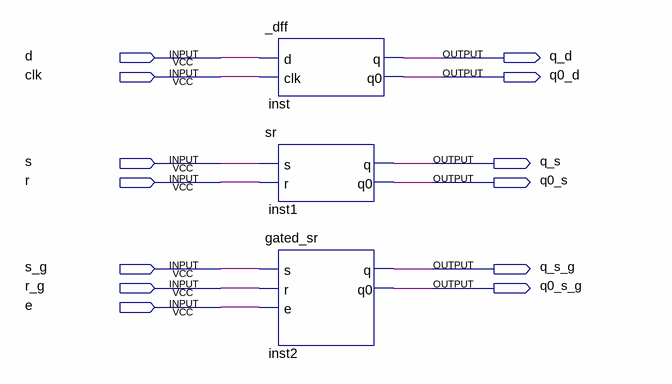
[diagram p0: schematic sheet]
// Quartus schematic latches.bdf as structural Verilog: 3 symbols, 13 pins
module latches (
  input  d,
  input  clk,
  input  s,
  input  r,
  input  s_g,
  input  r_g,
  input  e,
  output q_d,
  output q0_d,
  output q_s,
  output q0_s,
  output q_s_g,
  output q0_s_g
);

  _dff inst (.d(d), .clk(clk), .q(q_d), .q0(q0_d));
  sr inst1 (.s(s), .r(r), .q(q_s), .q0(q0_s));
  gated_sr inst2 (.s(s_g), .r(r_g), .e(e), .q(q_s_g), .q0(q0_s_g));
endmodule
